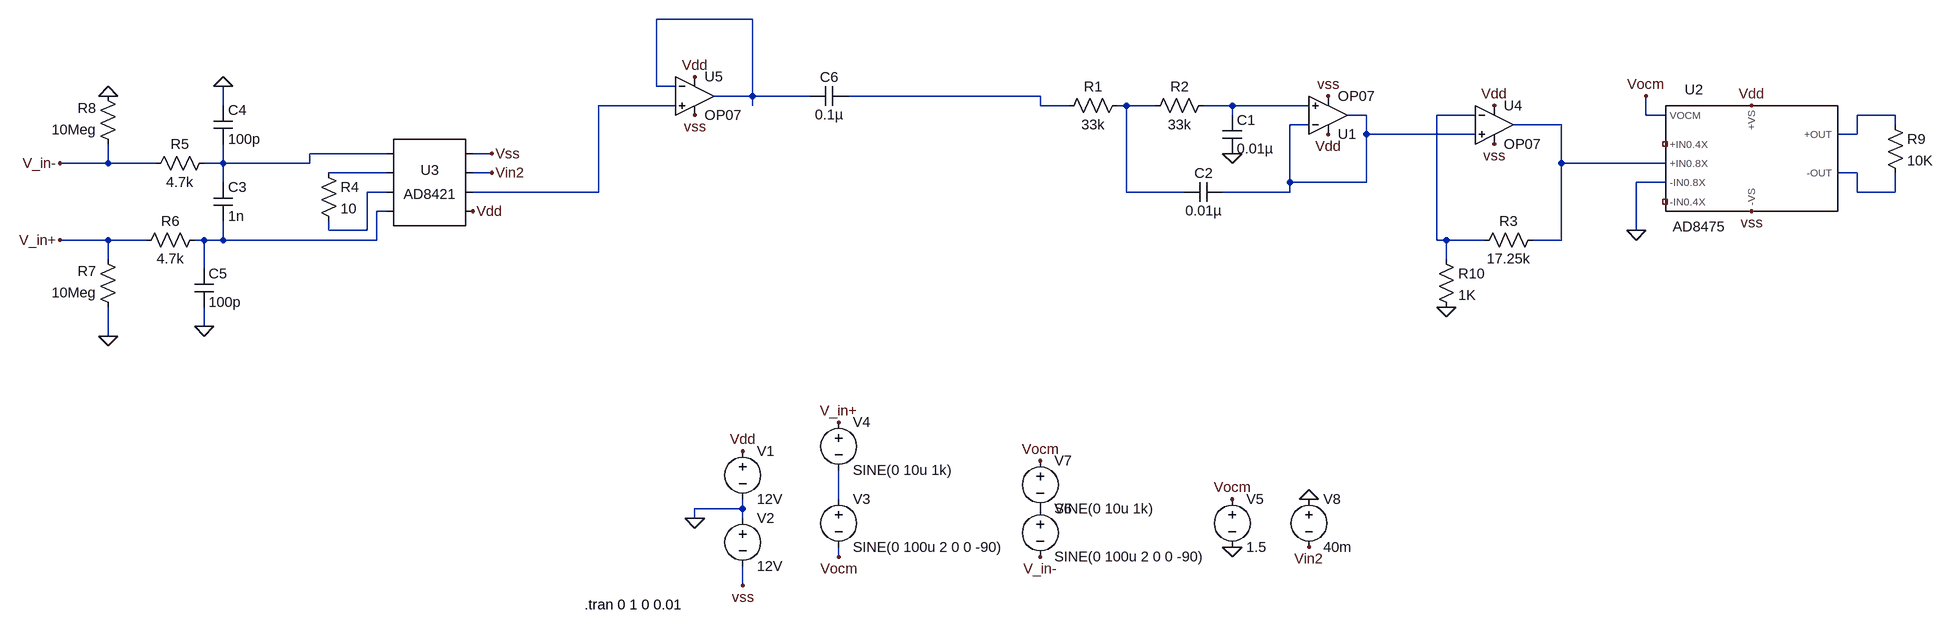
[diagram p0: schematic EEG.asc]
EEG.asc, the LTspice schematic file:
Version 4
SHEET 1 1528 1224
WIRE -688 -128 -848 -128
WIRE -848 -16 -848 -128
WIRE -816 -16 -848 -16
WIRE -688 0 -688 -128
WIRE -688 0 -752 0
WIRE -592 0 -688 0
WIRE -208 0 -528 0
WIRE -1600 16 -1600 -16
WIRE -816 16 -944 16
WIRE -688 16 -688 0
WIRE -208 16 -208 0
WIRE -160 16 -208 16
WIRE -64 16 -80 16
WIRE -16 16 -64 16
WIRE 112 16 64 16
WIRE 240 16 112 16
WIRE 112 32 112 16
WIRE 336 32 304 32
WIRE 672 32 608 32
WIRE 1040 32 1040 0
WIRE 1072 32 1040 32
WIRE 1456 32 1392 32
WIRE 240 48 208 48
WIRE 816 48 736 48
WIRE 1456 48 1456 32
WIRE 336 64 336 32
WIRE 672 64 336 64
WIRE 1392 64 1392 32
WIRE 1392 64 1360 64
WIRE -1328 96 -1456 96
WIRE -1152 96 -1184 96
WIRE -1792 112 -1792 80
WIRE -1792 112 -1872 112
WIRE -1712 112 -1792 112
WIRE -1600 112 -1600 80
WIRE -1600 112 -1632 112
WIRE -1456 112 -1456 96
WIRE -1456 112 -1600 112
WIRE 816 112 816 48
WIRE 1072 112 816 112
WIRE -1328 128 -1424 128
WIRE -1152 128 -1184 128
WIRE 1392 128 1360 128
WIRE -1600 144 -1600 112
WIRE 208 144 208 48
WIRE 336 144 336 64
WIRE 336 144 208 144
WIRE 1072 144 1024 144
WIRE -1328 160 -1360 160
WIRE -944 160 -944 16
WIRE -944 160 -1184 160
WIRE -64 160 -64 16
WIRE 32 160 -64 160
WIRE 208 160 208 144
WIRE 208 160 96 160
WIRE 1392 160 1392 128
WIRE 1456 160 1456 128
WIRE 1456 160 1392 160
WIRE -1328 192 -1344 192
WIRE -1424 224 -1424 208
WIRE -1360 224 -1360 160
WIRE -1360 224 -1424 224
WIRE 1024 224 1024 144
WIRE -1792 240 -1872 240
WIRE -1728 240 -1792 240
WIRE -1632 240 -1648 240
WIRE -1600 240 -1600 208
WIRE -1600 240 -1632 240
WIRE -1344 240 -1344 192
WIRE -1344 240 -1600 240
WIRE 608 240 608 32
WIRE 624 240 608 240
WIRE 688 240 624 240
WIRE 816 240 816 112
WIRE 816 240 768 240
WIRE -1792 272 -1792 240
WIRE 624 272 624 240
WIRE -1632 288 -1632 240
WIRE -1632 384 -1632 352
WIRE -1792 400 -1792 352
WIRE -544 672 -544 624
WIRE -704 688 -704 672
WIRE -704 688 -784 688
WIRE -784 704 -784 688
WIRE -704 704 -704 688
WIRE -544 768 -544 752
WIRE -704 816 -704 784
FLAG 112 96 0
FLAG 272 0 vss
FLAG 272 64 Vdd
FLAG -704 592 Vdd
FLAG -704 816 vss
FLAG 1216 192 vss
FLAG 1216 16 Vdd
FLAG 1024 224 0
FLAG -544 544 V_in+
FLAG -1872 240 V_in+
FLAG -1152 96 Vss
FLAG -1184 192 Vdd
FLAG -1632 384 0
FLAG -1600 -16 0
FLAG -1792 0 0
FLAG -1792 400 0
FLAG -1872 112 V_in-
FLAG -784 704 0
FLAG 112 752 0
FLAG 112 672 Vocm
FLAG 1040 0 Vocm
FLAG -208 768 V_in-
FLAG -544 768 Vocm
FLAG -208 608 Vocm
FLAG 624 352 0
FLAG 704 80 vss
FLAG 704 16 Vdd
FLAG -784 32 vss
FLAG -784 -32 Vdd
FLAG 240 672 0
FLAG 240 752 Vin2
FLAG -1152 128 Vin2
SYMBOL voltage -704 576 R0
WINDOW 123 0 0 Left 2
WINDOW 39 0 0 Left 2
SYMATTR InstName V1
SYMATTR Value 12V
SYMBOL voltage -704 688 R0
WINDOW 123 0 0 Left 2
WINDOW 39 0 0 Left 2
SYMATTR InstName V2
SYMATTR Value 12V
SYMBOL voltage -544 656 R0
WINDOW 123 0 0 Left 2
WINDOW 39 0 0 Left 2
SYMATTR InstName V3
SYMATTR Value SINE(0 100u 2 0 0 -90)
SYMBOL Opamps\\OP07 272 96 M180
SYMATTR InstName U1
SYMBOL AutoGenerated\\AD8475 1312 96 R0
SYMATTR InstName U2
SYMBOL res -64 0 R90
WINDOW 0 0 56 VBottom 2
WINDOW 3 32 56 VTop 2
SYMATTR InstName R1
SYMATTR Value 33k
SYMBOL res 80 0 R90
WINDOW 0 0 56 VBottom 2
WINDOW 3 32 56 VTop 2
SYMATTR InstName R2
SYMATTR Value 33k
SYMBOL cap 96 32 R0
SYMATTR InstName C1
SYMATTR Value 0.01µ
SYMBOL cap 96 144 R90
WINDOW 0 0 32 VBottom 2
WINDOW 3 32 32 VTop 2
SYMATTR InstName C2
SYMATTR Value 0.01µ
SYMBOL voltage -544 528 R0
WINDOW 123 0 0 Left 2
WINDOW 39 0 0 Left 2
SYMATTR InstName V4
SYMATTR Value SINE(0 10u 1k)
SYMBOL AutoGenerated\\AD8421 -1264 144 R0
SYMATTR InstName U3
SYMBOL res -1440 112 R0
SYMATTR InstName R4
SYMATTR Value 10
SYMBOL res -1616 96 R90
WINDOW 0 0 56 VBottom 2
WINDOW 3 32 56 VTop 2
SYMATTR InstName R5
SYMATTR Value 4.7k
SYMBOL res -1632 224 R90
WINDOW 0 0 56 VBottom 2
WINDOW 3 32 56 VTop 2
SYMATTR InstName R6
SYMATTR Value 4.7k
SYMBOL res -1776 368 R180
WINDOW 0 36 76 Left 2
WINDOW 3 36 40 Left 2
SYMATTR InstName R7
SYMATTR Value 10Meg
SYMBOL res -1776 96 R180
WINDOW 0 36 76 Left 2
WINDOW 3 36 40 Left 2
SYMATTR InstName R8
SYMATTR Value 10Meg
SYMBOL cap -1616 144 R0
SYMATTR InstName C3
SYMATTR Value 1n
SYMBOL cap -1616 16 R0
SYMATTR InstName C4
SYMATTR Value 100p
SYMBOL cap -1648 288 R0
SYMATTR InstName C5
SYMATTR Value 100p
SYMBOL res 1440 32 R0
SYMATTR InstName R9
SYMATTR Value 10K
SYMBOL voltage 112 656 R0
WINDOW 123 0 0 Left 2
WINDOW 39 0 0 Left 2
SYMATTR InstName V5
SYMATTR Value 1.5
SYMBOL voltage -208 672 R0
WINDOW 123 0 0 Left 2
WINDOW 39 0 0 Left 2
SYMATTR InstName V6
SYMATTR Value SINE(0 100u 2 0 0 -90)
SYMBOL voltage -208 592 R0
WINDOW 123 0 0 Left 2
WINDOW 39 0 0 Left 2
SYMATTR InstName V7
SYMATTR Value SINE(0 10u 1k)
SYMBOL Opamps\\OP07 704 -16 R0
SYMATTR InstName U4
SYMBOL res 784 224 R90
WINDOW 0 0 56 VBottom 2
WINDOW 3 32 56 VTop 2
SYMATTR InstName R3
SYMATTR Value 17.25k
SYMBOL res 608 256 R0
SYMATTR InstName R10
SYMATTR Value 1K
SYMBOL cap -528 -16 R90
WINDOW 0 0 32 VBottom 2
WINDOW 3 32 32 VTop 2
SYMATTR InstName C6
SYMATTR Value 0.1µ
SYMBOL Opamps\\OP07 -784 -64 R0
SYMATTR InstName U5
SYMBOL voltage 240 656 R0
WINDOW 123 0 0 Left 2
WINDOW 39 0 0 Left 2
SYMATTR InstName V8
SYMATTR Value 40m
TEXT -968 848 Left 2 !.tran 0 1 0 0.01

The netlist it stands for:
* EEG.asc
V1 Vdd 0 12V
V2 0 vss 12V
V3 N015 Vocm SINE(0 100u 2 0 0 -90)
XU1 N005 N006 Vdd vss N006 LT1001  ; OP07, pins In+ In- V+ V- OUT
XU2 0 NC_01 Vdd Vocm N008 N012 vss NC_02 N009 AD8475  ; pins -IN0.8X -IN0.4X +VS VOCM +OUT -OUT -VS +IN0.4X +IN0.8X
R1 N004 N002 33k
R2 N005 N004 33k
C1 N005 0 0.01µ
C2 N006 N004 0.01µ
V4 V_in+ N015 SINE(0 10u 1k)
* U3: AD8421 (symbol AutoGenerated\AD8421 not available, pins judged from their places): pin1=N010 pin2=N011 pin3=N013 pin4=N014 pin5=vss pin6=Vin2 pin7=N003 pin8=Vdd
R4 N011 N013 10
R5 N010 V_in- 4.7k
R6 N014 V_in+ 4.7k
R7 0 V_in+ 10Meg
R8 V_in- 0 10Meg
C3 N010 N014 1n
C4 0 N010 100p
C5 N014 0 100p
R9 N008 N012 10K
V5 Vocm 0 1.5
V6 P001 V_in- SINE(0 100u 2 0 0 -90)
V7 Vocm P001 SINE(0 10u 1k)
XU4 N006 N007 Vdd vss N009 LT1001  ; OP07, pins In+ In- V+ V- OUT
R3 N009 N007 17.25k
R10 N007 0 1K
C6 N002 N001 0.1µ
XU5 N003 N001 Vdd vss N001 LT1001  ; OP07, pins In+ In- V+ V- OUT
V8 0 Vin2 40m
.tran 0 1 0 0.01
.lib LTC.lib
.lib C:\users\wac\My Documents\repo\iowlabs\EEG\hardware\simulations\ad8475.cir
.backanno
.end